# EasyEDA Pro project DressingEth.eprj

# Schematic DressingEth
Board Name: DressingEth; Create Date: 2024-12-09; Page Name: DressingEth; Project Name: DressingEth; Schematic Name: DressingEth; Update Date: 2024-12-20; Company: EasyEDA.com; Drawn: EasyEDA; Page Size: A4; Part Number: JLCPCB-002; Reviewed: EasyEDA; Version: V0.1
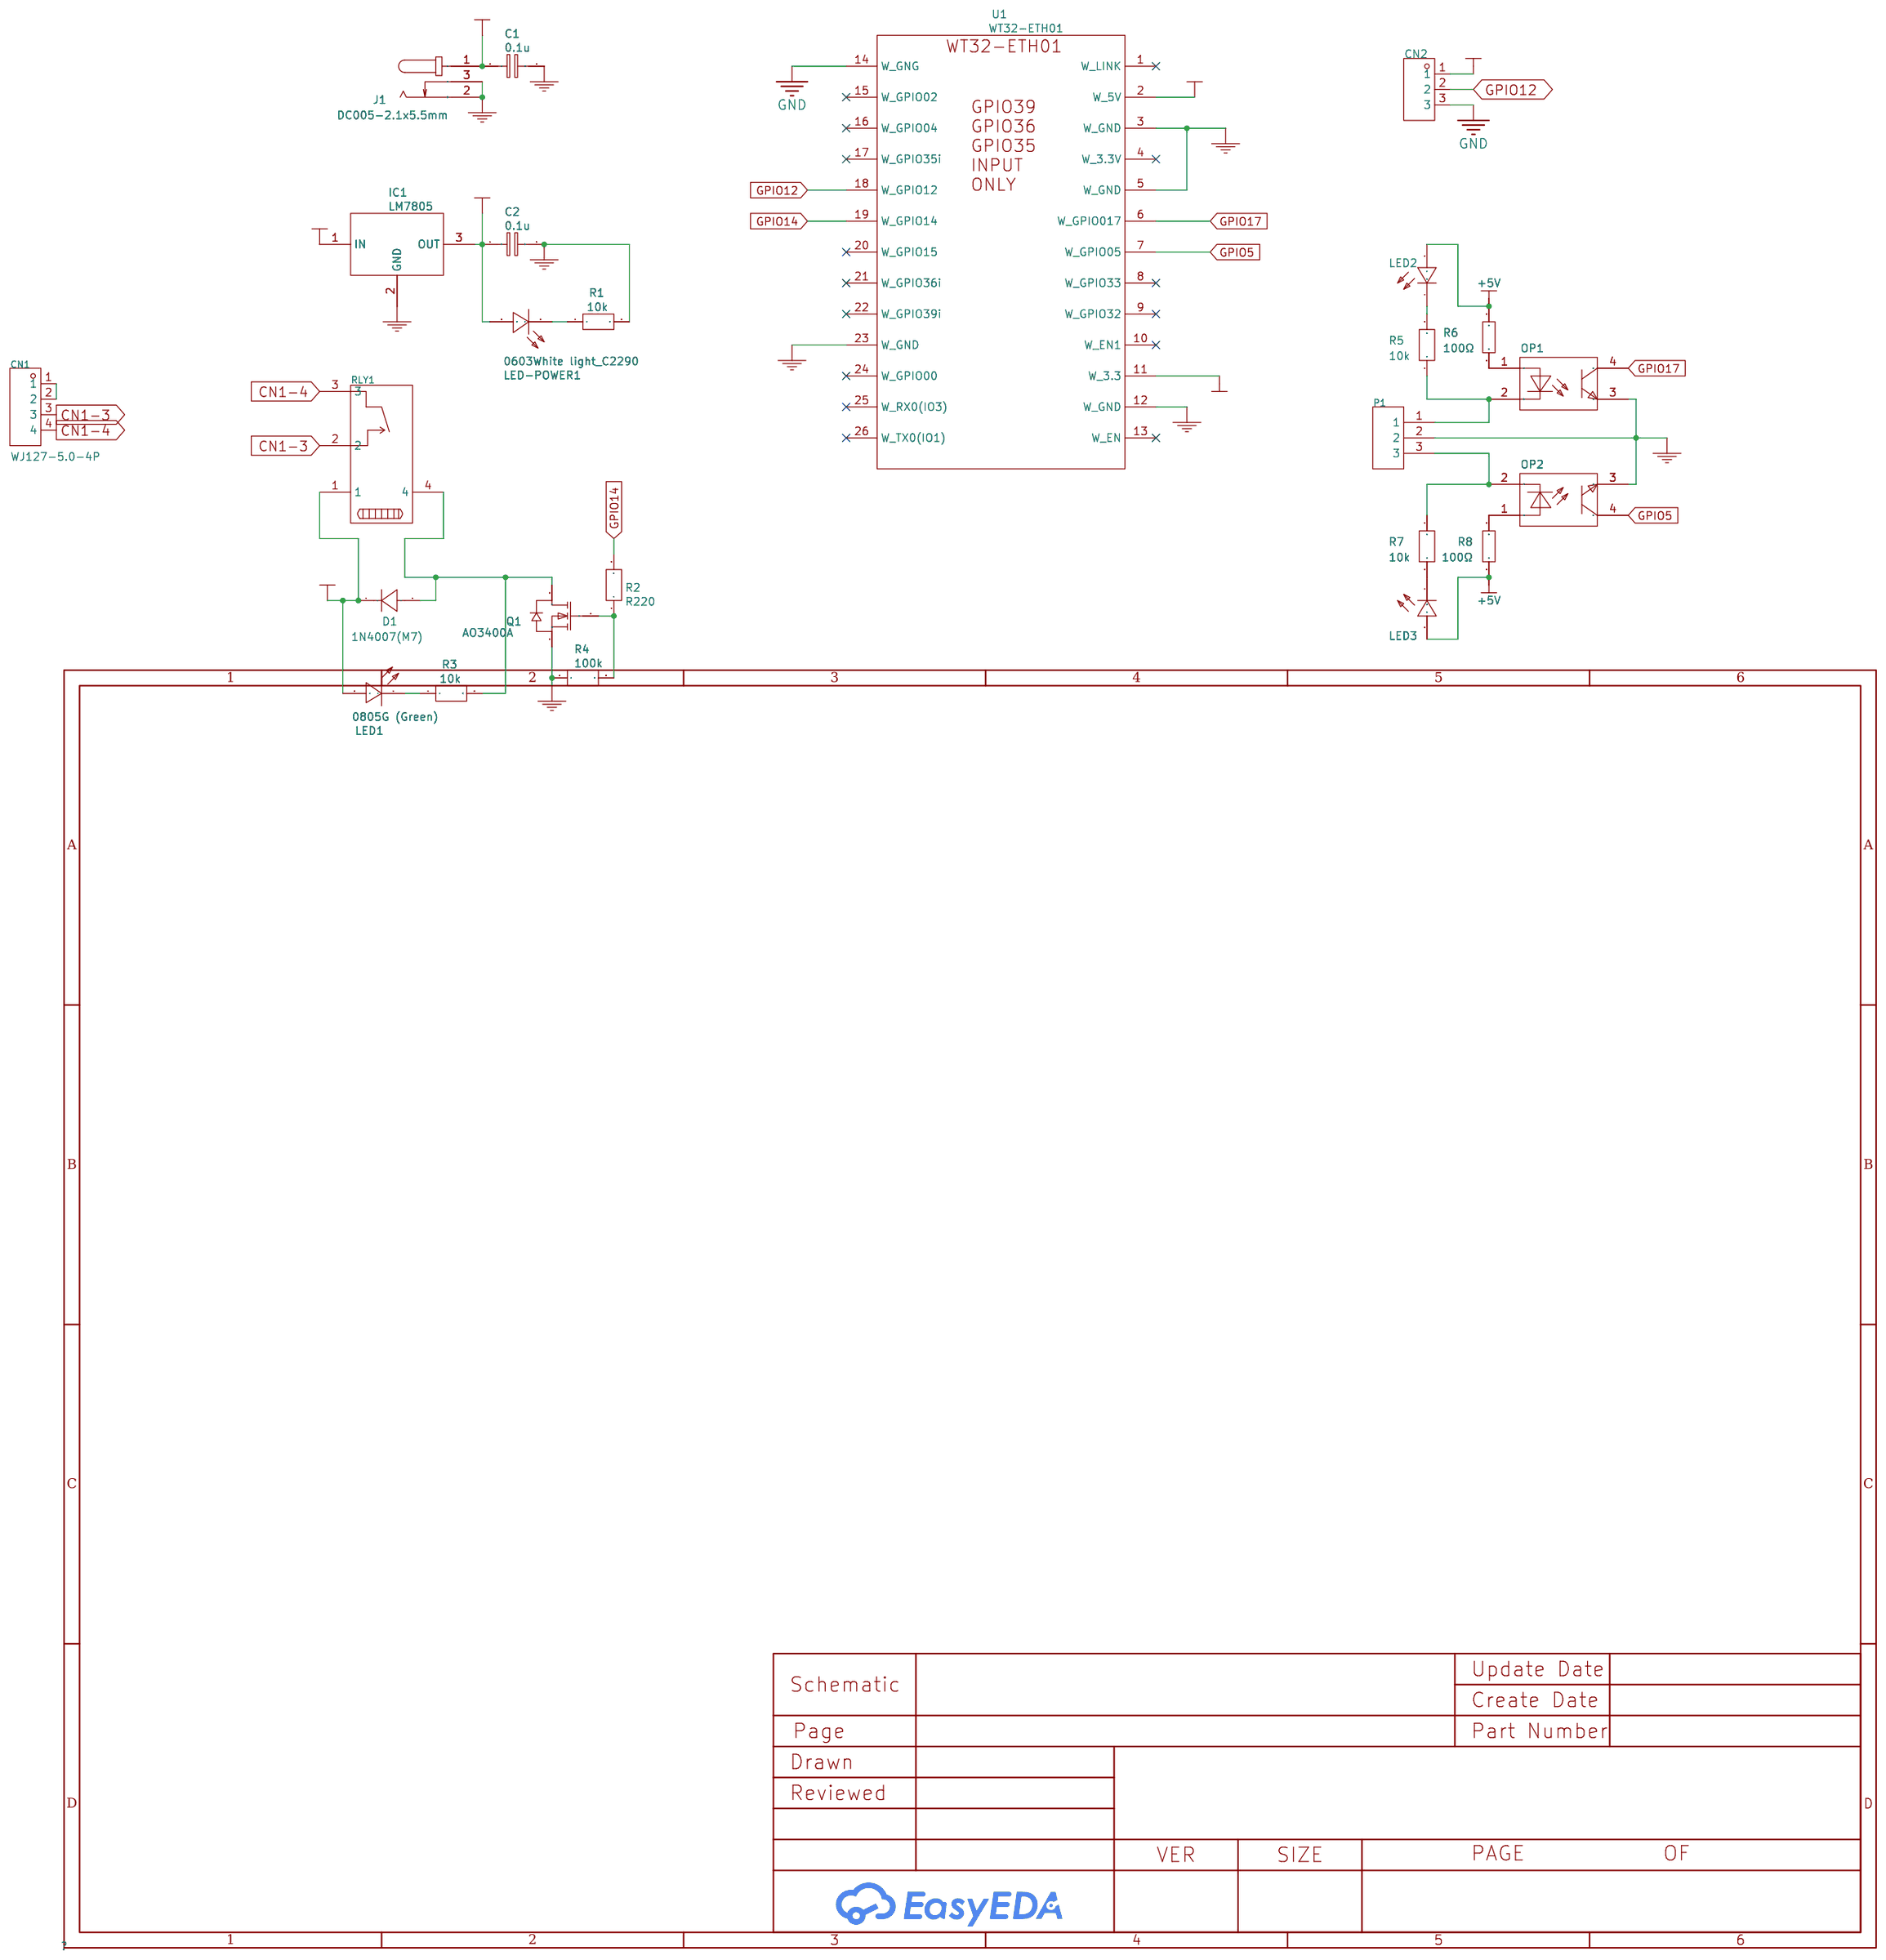
[diagram p0: schematic sheet]

## Parts
C1  0.1u  [C0603]
C2  0.1u  [C0603]
CN1  WJ127-5.0-4P  [CONN-TH_4P-P5.00_WJ127-5.0-4P]  (no BOM)
CN2  XH2.54-3A  [CONN-TH_3P-P2.50_HCTL_XH-3A-L]  (no BOM)
D1  1N4007(M7)  [SMA_L4.3-W2.7-LS5.1-RD]
IC1  LM7805  [LM7805]  (no BOM)
J1  DC005-2.1x5.5mm  [DC-IN-TH_POWER-JACK]  (no BOM)
LED1  0805G (Green)  [LED0805-RD_GREEN]
LED2  19-213/Y2C-CQ2R2L/3T(CY)  [LED0603-RD-YELLOW]
LED3  19-213/Y2C-CQ2R2L/3T(CY)  [LED0603-RD-YELLOW]
LED-POWER1  0603White light_C2290  [LED0603-R-RD_WHITE]
OP1  EL817S1(C)(TU)-F  [OPTO-SMD-4_L4.6-W6.5-P2.54-LS10.3-TL]
OP2  EL817S1(C)(TU)-F  [OPTO-SMD-4_L4.6-W6.5-P2.54-LS10.3-TL]
P1  WJ127-5.0-3P  [CONN-TH_3P-P5.00_WJ127-5.0-3P]  (no BOM)
Q1  AO3400A  [SOT-23-3_L2.9-W1.6-P1.90-LS2.8-BR]
R1  10k  [R0603]
R2  R220  [R0603]
R3  10k  [R0603]
R4  100k  [R0603]
R5  10k  [R0603]
R6  100Ω  [R0805]
R7  10k  [R0603]
R8  100Ω  [R0805]
RLY1  G5NB-1A-E-DC5V  [RELAY-TH_G5NB-1A-E-DCXX]  (no BOM)
U1  WT32-ETH01  [WT32-ETH01-M]  (no BOM)

## Library data of the parts
C1 C2 = 0.1u: Supplier Part: C1525; Supplier: LCSC; Manufacturer Part: CL05B104KO5NNNC; Manufacturer: SAMSUNG(三星)
CN1 = WJ127-5.0-4P: LCSC Part Name: 5mm 1x4P 排数:1 每排P数:4 直插; Supplier Part: C192779; Manufacturer: KANGNEX(康奈克斯电气); Supplier Footprint: 插件,P=5mm; JLCPCB Part Class: Extended Part; Datasheet: https://atta.szlcsc.com/upload/public/pdf/source/20191225/C192779_DBD79F61C9FABD31EC3EFBBD98D95251.pdf; Supplier: LCSC; Structure: 1x4P; Pitch: 5mm; Color: Green; Mounting Style: Straight; Current Rating (Max): 15A; Voltage Rating (Max): 250V; Number of Pins: 4P; Number of Rows: 1; Wire Gauge - AWG: 14~26; Wire Gauge - mm2: 1.5; Number of PINs Per Row: 4; Operating Temperature Range: -40℃~+105℃
CN2 = XH2.54-3A: Supplier Part: C9900018379; Supplier: LCSC
D1 = 1N4007(M7): Supplier: LCSC; Supplier Part: C2988638; Manufacturer: UMW(友台半导体); JLCPCB Part Class: Extended Part
IC1 = LM7805: sim: true
J1 = DC005-2.1x5.5mm: Supplier: LCSC; Supplier Part: C9900001795; Manufacturer: 索峰; Manufacturer Part: POWER-JACK; JLCPCB Part Class: Extended Part
LED1 = 0805G (Green): Supplier: LCSC; Manufacturer: KENTO; Supplier Part: C2297; JLCPCB Part Class: Basic Part
LED2 LED3 = 19-213/Y2C-CQ2R2L/3T(CY): LCSC Part Name: 黄灯; Supplier Part: C72038; Manufacturer: EVERLIGHT(亿光); Supplier Footprint: 0603; JLCPCB Part Class: Basic Part; Datasheet: https://atta.szlcsc.com/upload/public/pdf/source/20160507/1462613613586.pdf; Supplier: LCSC; Emitted Color: Yellow; Power Dissipation: 60mW; Forward Current: 20mA; Dominant Wavelength: 585.5nm~591.5nm; Peak Wavelength: 591nm; Lens Color: 无色透明透镜; Viewing Angle: 120°; Operating Temperature: -40℃~+85℃
LED-POWER1 = 0603White light_C2290: Supplier: LCSC; Manufacturer: KENTO; Manufacturer Part: KT-0603W; Supplier Part: C2290; JLCPCB Part Class: Basic Part
OP1 OP2 = EL817S1(C)(TU)-F: Supplier: LCSC; Manufacturer: EVERLIGHT(亿光); Supplier Part: C106900; JLCPCB Part Class: Basic Part
P1 = WJ127-5.0-3P: LCSC Part Name: 5mm 1x3P 排数:1 每排P数:3 直插; Supplier Part: C8393; Manufacturer: KANGNEX(康奈克斯电气); Supplier Footprint: 插件,P=5mm; JLCPCB Part Class: Extended Part; Datasheet: https://atta.szlcsc.com/upload/public/pdf/source/20191225/C8393_D72692E3E43042C26B9E7345DD336F60.pdf; Supplier: LCSC; Structure: 1x3P; Pitch: 5mm; Color: Green; Mounting Style: Straight; Current Rating (Max): 15A; Voltage Rating (Max): 250V; Number of Pins: 3P; Number of Rows: 1; Wire Gauge - AWG: 14~26; Wire Gauge - mm2: 1.5; Number of PINs Per Row: 3; Operating Temperature Range: -40℃~+105℃
Q1 = AO3400A: Supplier: LCSC; Manufacturer: AOS; Supplier Part: C20917; JLCPCB Part Class: Basic Part
R1 R3 R5 R7 = 10k: Supplier Part: C25804; Supplier: LCSC; Manufacturer Part: 0603WAF1002T5E; Manufacturer: UNI-ROYAL(厚声)
R2 = R220: Supplier Part: C22962; Supplier: LCSC; Manufacturer Part: 0603WAF2200T5E; Manufacturer: UNI-ROYAL(厚声)
R4 = 100k: Supplier Part: C25803; Supplier: LCSC; Manufacturer Part: 0603WAF1003T5E; Manufacturer: UNI-ROYAL(厚声)
R6 R8 = 0805W8F1000T5E_C17408: LCSC Part Name: 100Ω ±1% 125mW 厚膜电阻; Supplier Part: C17408; Manufacturer: UNI-ROYAL(厚声); Manufacturer Part: 0805W8F1000T5E; Supplier Footprint: 0805; JLCPCB Part Class: Basic Part; Datasheet: https://atta.szlcsc.com/upload/public/pdf/source/20200306/C422600_1E6D84923E4A46A82E41ADD87F860B5C.pdf; Supplier: LCSC; Type: Thick Film Resistors; Tolerance: ±1%; Temperature Coefficient: ±100ppm/℃; Operating Temperature Range: -55℃~+155℃
RLY1 = G5NB-1A-E-DC5V: Supplier Part: C48746; Manufacturer: OMRON(欧姆龙); Supplier Footprint: 插件,7x20.4mm; JLCPCB Part Class: Extended Part; Supplier: LCSC
U1 = WT32-ETH01: Manufacturer: Wireless-Tag; link: http://www.wireless-tag.com/wp-content/uploads/2020/08/WT32-ETH01规格书V1.2EN（英文）.pdf

## Nets
+3.3V: CN2.1 U1.11(W_3.3)
+5V: C2.1 D1.1(K) IC1.3(OUT) LED1.2(A) LED2.2(A) LED3.2(A) LED-POWER1.1(A) R6.1 R8.1 RLY1.1 U1.2(W_5V)
GND: C1.2 C2.2 CN2.3 IC1.2(GND) J1.2(GND) J1.3 OP1.3(EM) OP2.3(EM) P1.2 Q1.2(S) R1.2 R4.1 U1.3(W_GND) U1.5(W_GND) U1.12(W_GND) U1.14(W_GNG) U1.23(W_GND)
VCC: C1.1 IC1.1(IN) J1.1(VCC)
CN1-3: CN1.3 RLY1.2
CN1-4: CN1.4 RLY1.3
GPIO5: OP2.4(COL) U1.7(W_GPIO05)
GPIO12: CN2.2 U1.18(W_GPIO12)
GPIO14: R2.2 U1.19(W_GPIO14)
GPIO17: OP1.4(COL) U1.6(W_GPIO017)
$1N3: D1.2(A) Q1.3(D) R3.2 RLY1.4
$1N5: Q1.1(G) R2.1 R4.2
$1N15: LED1.1(K) R3.1
$1N16: LED-POWER1.2(K) R1.1
$1N15278: OP1.1(AN) R6.2
$1N15297: OP1.2(CAT) P1.1 R5.1
$1N19667: OP2.1(AN) R8.2
$1N19668: OP2.2(CAT) P1.3 R7.1
$1N20033: LED2.1(C) R5.2
$1N20065: LED3.1(C) R7.2
$1N20786: CN1.1 CN1.2

Not connected (* = marked no-connect by the designer): U1 1(W_LINK)* 4(W_3.3V)* 8(W_GPIO33)* 9(W_GPIO32)* 10(W_EN1)* 13(W_EN)* 15(W_GPIO02)* 16(W_GPIO04)* 17(W_GPIO35i)* 20(W_GPIO15)* 21(W_GPIO36i)* 22(W_GPIO39i)* 24(W_GPIO00)* 25(W_RX0(IO3))* 26(W_TX0(IO1))*

# Board DressingEth
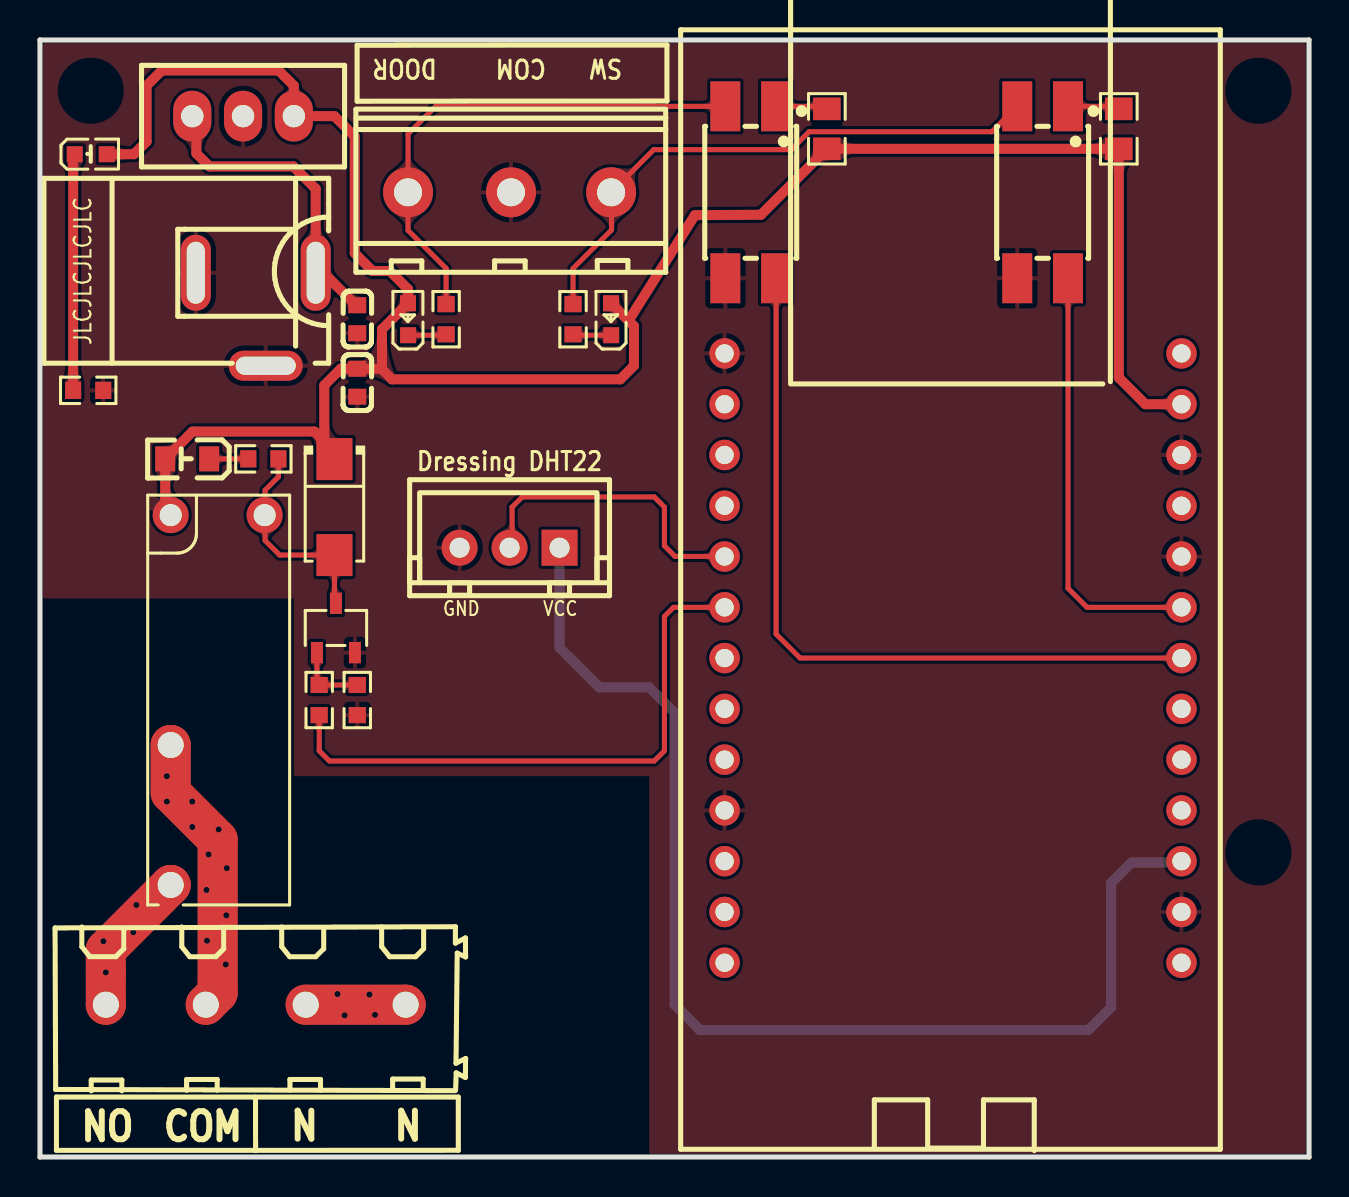
[diagram p1: board, top side]
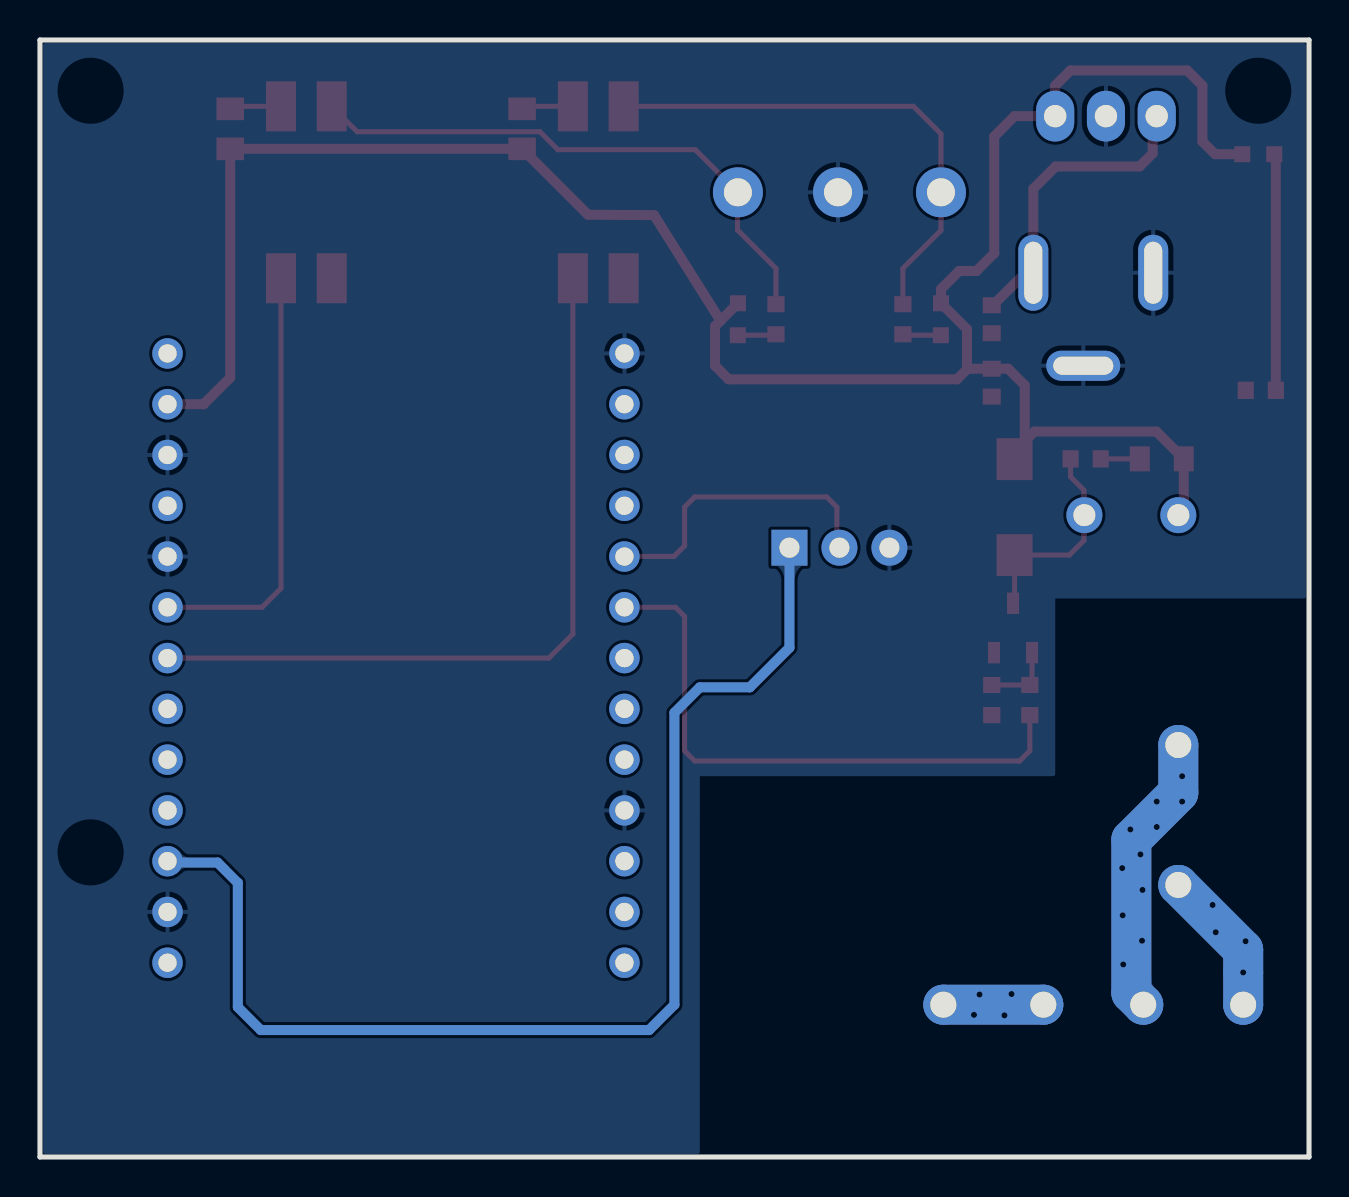
[diagram p2: board, bottom side, seen from below]

Outline 63.49 x 55.88 mm; copper layers: Top Layer, Bottom Layer. Coordinates in mm from the lower left corner of the outline.
Outline path: 0,55.88 63.49,55.88 63.49,0 0,0 0,55.88
Stack: Top Layer 0.035mm / Dielectric1 1.51mm FR4 er 4.5 / Bottom Layer 0.035mm

## Design rules (mm)
template: User Custom Config
spacing Default (default): track to track 0.152, other pairs 0 to 0.152
track width Default (default): min 0.254, default 0.254, max 25.4
track width 0.5mm: min 0.5, default 0.5, max 2.54
differential pair differentialPair (default): width min 0.127, default 0.254, max 2.54; gap min 0.152, default 0.152
via Default (default): diameter min 0.61, default 0.61, max 100.025; hole min 0.305, default 0.305, max 59.995
net +5V uses 0.5mm
net VCC uses 0.5mm
net +3.3V uses 0.5mm

## Placement (name value [footprint] x y rotation side)
C1  0.1u  [C0603]  15.88 41.91 270 top
C2  0.1u  [C0603]  15.88 38.73 270 top
CN1  WJ127-5.0-4P  [CONN-TH_4P-P5.00_WJ127-5.0-4P]  10.79 7.62 180 top
CN2  XH2.54-3A  [CONN-TH_3P-P2.50_HCTL_XH-3A-L]  23.5 30.48 0 top
D1  1N4007(M7)  [SMA_L4.3-W2.7-LS5.1-RD]  14.73 32.51 270 top
IC1  -  [LM7805]  10.16 52.07 0 top
J1  DC005-2.1x5.5mm  [DC-IN-TH_POWER-JACK]  10.79 41.91 0 top
LED1  0805G (Green)  [LED0805-RD_GREEN]  7.37 34.92 0 top
LED2  19-213/Y2C-CQ2R2L/3T(CY)  [LED0603-RD-YELLOW]  28.57 41.91 90 top
LED3  19-213/Y2C-CQ2R2L/3T(CY)  [LED0603-RD-YELLOW]  18.41 41.91 90 top
LED-POWER1  0603White light_C2290  [LED0603-R-RD_WHITE]  2.54 50.17 0 top
OP1  EL817S1(C)(TU)-F  [OPTO-SMD-4_L4.6-W6.5-P2.54-LS10.3-TL]  50.16 48.26 270 top
OP2  EL817S1(C)(TU)-F  [OPTO-SMD-4_L4.6-W6.5-P2.54-LS10.3-TL]  35.56 48.26 270 top
P1  WJ127-5.0-3P  [CONN-TH_3P-P5.00_WJ127-5.0-3P]  23.5 48.26 180 top
Q1  AO3400A  [SOT-23-3_L2.9-W1.6-P1.90-LS2.8-BR]  14.81 26.47 90 top
R1  10k  [R0603]  2.41 38.35 0 top
R2  R220  [R0603]  13.97 22.86 270 top
R3  10k  [R0603]  11.18 34.92 0 top
R4  100k  [R0603]  15.88 22.86 90 top
R5  10k  [R0603]  26.67 41.91 270 top
R6  100Ω  [R0805]  53.97 51.44 90 top
R7  10k  [R0603]  20.32 41.91 270 top
R8  100Ω  [R0805]  39.37 51.44 90 top
RLY1  G5NB-1A-E-DC5V  [RELAY-TH_G5NB-1A-E-DCXX]  8.89 22.86 270 top
U1  WT32-ETH01  [WT32-ETH01-M]  45.09 26.67 270 top

## Footprints (pads in the part's own frame, mm; a bottom-side part is the same pattern mirrored in y, then rotated)
C0603
  rect 0.8x0.9 smd: 1(-0.7,0) 2(0.7,0)
CONN-TH_3P-P2.50_HCTL_XH-3A-L
  rect 1.8x1.8 hole 1: 1(2.5,0)
  round 1.8 hole 1: 2(0,0) 3(-2.5,0)
CONN-TH_3P-P5.00_WJ127-5.0-3P
  round 2.5 hole 1.4: 1(-5.08,0) 2(-0.071,0) 3(5.08,0)
CONN-TH_4P-P5.00_WJ127-5.0-4P
  round 2 hole 1.3: 1(-7.5,0) 2(-2.5,0) 3(2.5,0) 4(7.5,0)
DC-IN-TH_POWER-JACK
  oval 1.5x3.8 hole 0.9x3.1: 1(3,2.325) 2(-2.999,2.325)
  oval 3.7x1.5 hole 3x0.9: 3(0.5,-2.325)
LED0603-R-RD_WHITE
  rect 0.8x0.8 smd: 1(0.8,0) 2(-0.8,0)
LED0603-RD-YELLOW
  rect 0.8x0.8 smd: 1(-0.799,-0.004) 2(0.799,0.004)
LED0805-RD_GREEN
  rect 1x1.25 smd: 1(1.1,0) 2(-1.099,0)
LM7805
  oval 1.905x2.54 hole 1.117: 1(-2.54,0) 2(0,0) 3(2.54,0)
OPTO-SMD-4_L4.6-W6.5-P2.54-LS10.3-TL
  rect 2.5x1.5 smd: 1(-4.3,1.27) 2(-4.3,-1.27) 3(4.3,-1.27) 4(4.3,1.27)
R0603
  rect 0.806x0.864 smd: 1(-0.753,0) 2(0.753,0)
R0805
  rect 1.133x1.377 smd: 1(-1,0) 2(1,0)
RELAY-TH_G5NB-1A-E-DCXX
  round 1.8 hole 1.1: 1(-9.25,-2.35) 4(-9.25,2.35)
  round 2 hole 1.3: 2(2.25,-2.35) 3(9.25,-2.35)
SMA_L4.3-W2.7-LS5.1-RD
  rect 2.1x1.8 smd: 1(-2.4,0) 2(2.4,0)
SOT-23-3_L2.9-W1.6-P1.90-LS2.8-BR
  rect 1.07x0.6 smd: 1(-1.235,0.95) 2(-1.235,-0.95) 3(1.236,0)
WT32-ETH01-M
  round 1.524 hole 0.914: 1(-13.529,12.027) 2(-10.989,12.027) 3(-8.449,12.027) 4(-5.909,12.027) 5(-3.369,12.027) 6(-0.829,12.027) 7(1.711,12.027) 8(4.251,12.027) 9(6.791,12.027) 10(9.331,12.027) 11(11.871,12.027) 12(14.411,12.027) 13(16.951,12.027) 14(-13.529,-10.833) 15(-10.989,-10.833) 16(-8.449,-10.833) 17(-5.909,-10.833) 18(-3.369,-10.833) 19(-0.829,-10.833) 20(1.711,-10.833) 21(4.251,-10.833) 22(6.791,-10.833) 23(9.331,-10.833) 24(11.871,-10.833) 25(14.411,-10.833) 26(16.951,-10.833)

## Nets
As in the schematic.

Pads without a net: U1 1 4 8 9 10 13 15 16 17 20 21 22 24 25 26

## Via types
v1: diameter 0.61, hole 0.305, Top Layer to Bottom Layer, 19 vias

## Routing (per net, layer and track width the routed paths; a pad name or vN(x,y) marks a point on that pad's centre or on a via; arc(x,y) is an arc through that point)
+3.3V: length 59.7
  Bottom Layer w0.5: CN2.1 26,25.48 27.98,23.5 30.48,23.5 31.75,22.22 31.75,7.62 33.02,6.35 52.45,6.35 53.59,7.5 53.59,13.72 54.61,14.73 57.04,14.73 U1.11
+5V: length 111.3
  Top Layer w0.5: 14.22,35.8 14.73,35.29 D1.1 ; 14.22,35.8 14.22,38.61 15.05,39.44 C2.1 17.11,39.44 ; 14.22,35.8 13.73,36.29 7.63,36.29 LED1.2 6.27,32.38 RLY1.1 ; 17.11,39.44 17.11,41.41 LED3.2 18.41,43.42 17.5,44.32 16.64,44.32 15.75,45.21 15.75,51.05 14.73,52.07 IC1.3 12.7,53.59 11.94,54.36 6.1,54.36 5.33,53.59 5.33,50.8 4.7,50.17 LED-POWER1.1 ; 17.11,39.44 17.11,39.4 17.61,38.9 29.03,38.9 29.72,39.59 29.72,41.56 29.45,41.83 ; U1.2 55.31,37.66 53.97,38.99 R6.1 R8.1 36.07,47.14 32.77,47.12 29.45,41.83 ; 29.45,41.83 LED2.2
VCC: length 15.6
  Top Layer w0.5: C1.1 15.81,42.61 13.79,44.63 13.79,48.44 12.68,49.55 8.48,49.55 7.82,50.21 7.82,51.23 6.98,52.07
CN1-3: length 28.4
  Top Layer w2: CN1.3 8.89,8.22 8.89,15.88 6.54,18.22 RLY1.2
  Bottom Layer w2: CN1.3 8.89,8.22 8.89,15.88 6.54,18.22 RLY1.2
  vias: v1(6.35,19.05) v1(6.35,17.78) v1(7.62,17.78) v1(7.62,16.51) v1(8.33,13.36) v1(8.43,15.14) v1(8.36,10.82) v1(8.94,16.39) v1(9.35,14.45) v1(9.32,12.09) v1(9.3,9.63)
CN1-4: length 14.7
  Top Layer w2: 3.3,7.62 v1(3.3,9.23) 3.3,10.36 RLY1.3
  Bottom Layer w2: 3.3,7.62 v1(3.3,9.23) 3.3,10.36 RLY1.3
  vias: v1(3.17,10.8) v1(4.67,11.24) v1(4.82,12.61)
GPIO5: length 38.6
  Top Layer w0.254: U1.7 38.03,24.96 36.83,26.16 OP2.4
GPIO12: length 15.3
  Top Layer w0.254: U1.18 34.24,30.05 31.77,30.05 31.24,30.58 31.24,32.51 30.73,33.02 24.13,33.02 23.62,32.51 23.62,30.86 23.5,30.73 CN2.2
GPIO14: length 29.4
  Top Layer w0.254: U1.19 31.7,27.5 31.24,27.04 31.24,20.32 30.73,19.81 14.48,19.81 13.97,20.32 R2.2
GPIO17: length 21.6
  Top Layer w0.254: OP1.4 51.44,28.45 52.38,27.5 U1.6
$1N3: length 10.6
  Top Layer w0.254: 11.26,32.09 RLY1.4 ; 11.26,32.09 11.26,33.36 11.93,34.03 R3.2 ; 11.26,32.09 11.26,30.84 11.99,30.11 D1.2 14.73,27.78 Q1.3
$1N5: length 3.6
  Top Layer w0.254: Q1.1 13.86,23.72 R2.1 R4.2
$1N15: length 2
  Top Layer w0.254: LED1.1 R3.1
$1N16: length 11.8
  Top Layer w0.5: R1.1 1.66,50.08 LED-POWER1.2
$1N15278: length 2.6
  Top Layer w0.254: OP1.1 53.85,52.56 R6.2
$1N15297: length 28.5
  Top Layer w0.254: 48.9,52.56 47.62,51.29 38.48,51.29 37.58,50.39 30.71,50.39 28.6,48.28 ; 28.6,48.28 28.6,46.38 26.67,44.45 R5.1 ; 28.6,48.28 P1.1
$1N19667: length 2.6
  Top Layer w0.254: OP2.1 39.25,52.56 R8.2
$1N19668: length 25.8
  Top Layer w0.254: OP2.2 19.79,52.56 18.41,51.18 P1.3 18.41,46.36 20.32,44.45 R7.1
$1N20033: length 1.9
  Top Layer w0.254: R5.2 26.72,41.11 LED2.1
$1N20065: length 1.9
  Top Layer w0.254: LED3.1 20.27,41.11 R7.2
$1N20786: length 10
  Top Layer w2: CN1.2 CN1.1
  Bottom Layer w2: CN1.2 CN1.1
  vias: v1(14.88,8.15) v1(15.24,7.09) v1(16.48,8.13) v1(16.76,7.11)

## Copper pours and planes (outline as drawn; the poured copper is in the pictures)
GND on Top Layer: 96.52,0 30.48,0 30.48,19.05 12.7,19.05 12.7,27.94 0,27.94 0,55.88 96.52,55.88
GND on Bottom Layer: 96.52,0 30.48,0 30.48,19.05 12.7,19.05 12.7,27.94 0,27.94 0,55.88 96.52,55.88

Small or netless copper shapes (teardrops, artwork), in the pictures only: 62 on Top Layer, 3 on Bottom Layer

## Text on the board
Top Silkscreen Layer: GND | VCC | JLCJLCJLCJLC | Dressing DHT22 | DOOR | COM | SW | NO | N
